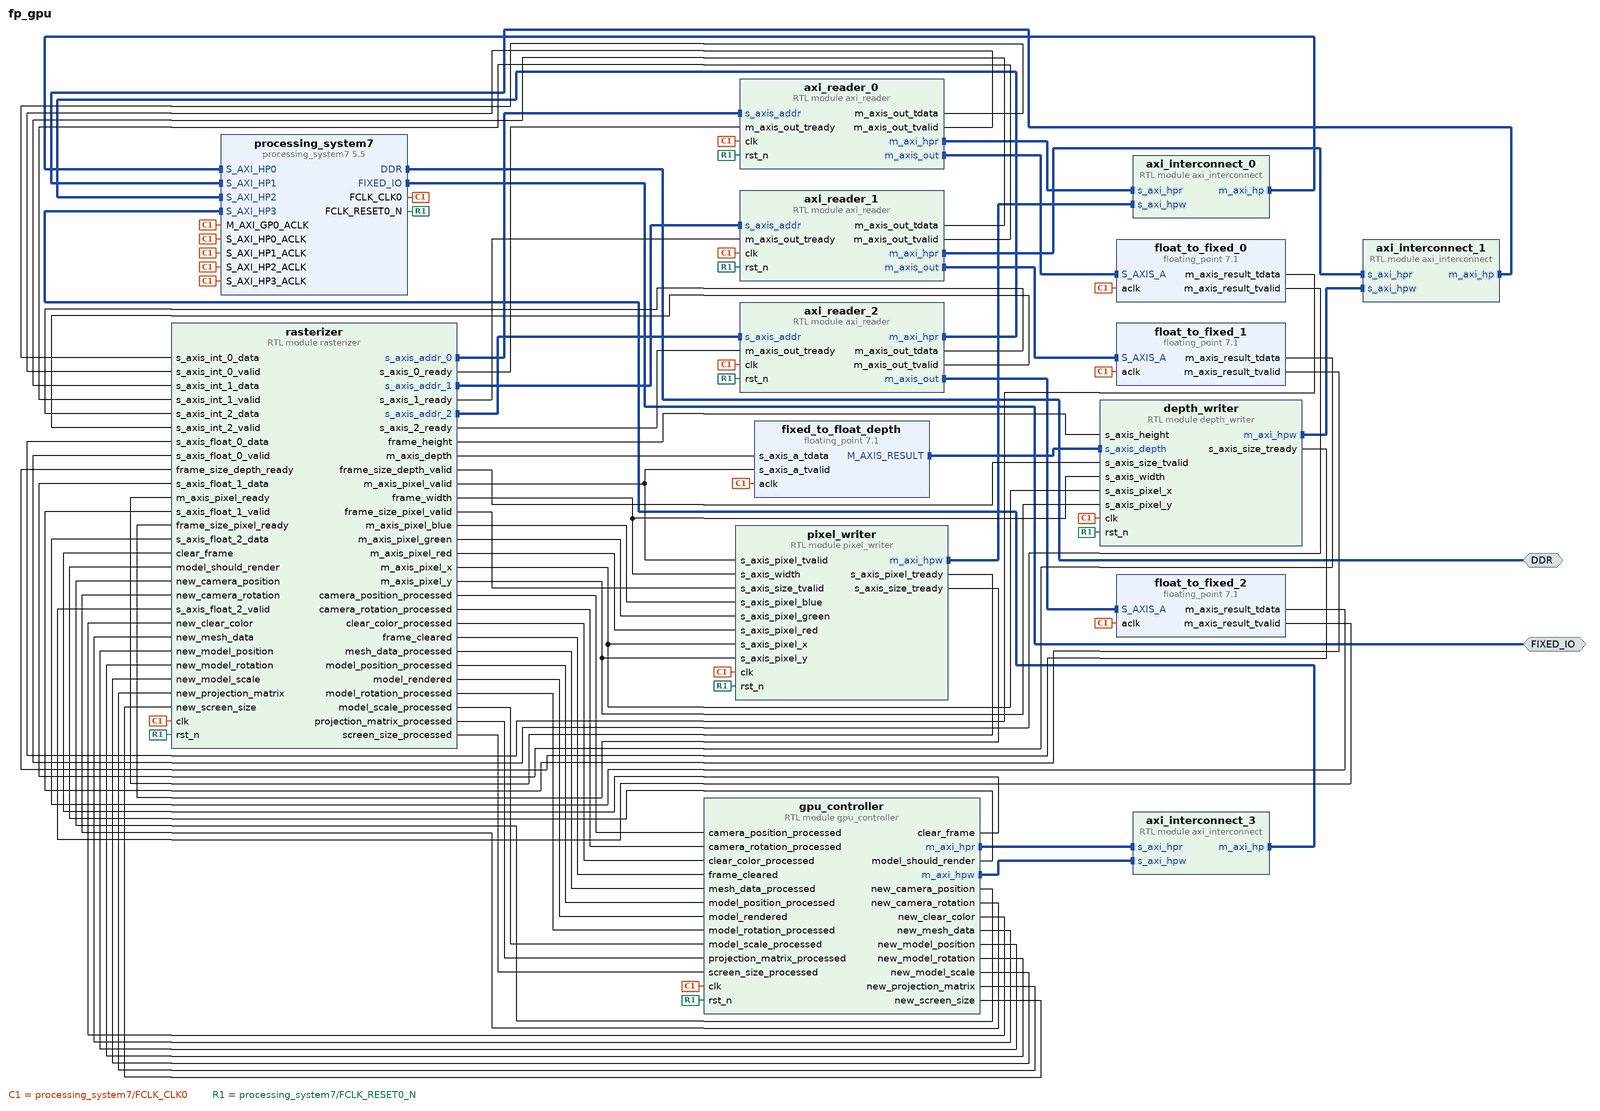
[diagram p0: block diagram of the top level]
# Vivado block design fp_gpu, xc7z020clg400-1, Vivado 2024.2
create_bd_design fp_gpu

create_bd_intf_port -mode Master -vlnv xilinx.com:interface:ddrx_rtl:1.0 DDR
create_bd_intf_port -mode Master -vlnv xilinx.com:display_processing_system7:fixedio_rtl:1.0 FIXED_IO

create_bd_cell -type ip -vlnv xilinx.com:ip:processing_system7:5.5 processing_system7
set_property -dict [list \
  CONFIG.PCW_APU_PERIPHERAL_FREQMHZ 650 \
  CONFIG.PCW_CRYSTAL_PERIPHERAL_FREQMHZ 50 \
  CONFIG.PCW_ENET0_ENET0_IO {MIO 16 .. 27} \
  CONFIG.PCW_ENET0_GRP_MDIO_ENABLE 1 \
  CONFIG.PCW_ENET0_GRP_MDIO_IO {MIO 52 .. 53} \
  CONFIG.PCW_ENET0_PERIPHERAL_ENABLE 1 \
  CONFIG.PCW_ENET0_RESET_ENABLE 1 \
  CONFIG.PCW_ENET0_RESET_IO {MIO 9} \
  CONFIG.PCW_ENET_RESET_ENABLE 1 \
  CONFIG.PCW_ENET_RESET_SELECT {Share reset pin} \
  CONFIG.PCW_FPGA0_PERIPHERAL_FREQMHZ 100 \
  CONFIG.PCW_FPGA1_PERIPHERAL_FREQMHZ 50 \
  CONFIG.PCW_GPIO_MIO_GPIO_ENABLE 1 \
  CONFIG.PCW_GPIO_MIO_GPIO_IO MIO \
  CONFIG.PCW_I2C_RESET_ENABLE 1 \
  CONFIG.PCW_M_AXI_GP0_FREQMHZ 10 \
  CONFIG.PCW_PERIPHERAL_BOARD_PRESET None \
  CONFIG.PCW_PRESET_BANK1_VOLTAGE {LVCMOS 1.8V} \
  CONFIG.PCW_QSPI_GRP_FBCLK_ENABLE 1 \
  CONFIG.PCW_QSPI_GRP_FBCLK_IO {MIO 8} \
  CONFIG.PCW_QSPI_GRP_SINGLE_SS_ENABLE 1 \
  CONFIG.PCW_QSPI_GRP_SINGLE_SS_IO {MIO 1 .. 6} \
  CONFIG.PCW_QSPI_PERIPHERAL_ENABLE 1 \
  CONFIG.PCW_QSPI_QSPI_IO {MIO 1 .. 6} \
  CONFIG.PCW_SD0_GRP_CD_ENABLE 1 \
  CONFIG.PCW_SD0_GRP_CD_IO {MIO 47} \
  CONFIG.PCW_SD0_GRP_WP_ENABLE 0 \
  CONFIG.PCW_SD0_PERIPHERAL_ENABLE 1 \
  CONFIG.PCW_SD0_SD0_IO {MIO 40 .. 45} \
  CONFIG.PCW_SDIO_PERIPHERAL_FREQMHZ 50 \
  CONFIG.PCW_SINGLE_QSPI_DATA_MODE x4 \
  CONFIG.PCW_S_AXI_HP0_DATA_WIDTH 32 \
  CONFIG.PCW_S_AXI_HP1_DATA_WIDTH 32 \
  CONFIG.PCW_S_AXI_HP2_DATA_WIDTH 32 \
  CONFIG.PCW_S_AXI_HP3_DATA_WIDTH 32 \
  CONFIG.PCW_UART0_PERIPHERAL_ENABLE 1 \
  CONFIG.PCW_UART0_UART0_IO {MIO 14 .. 15} \
  CONFIG.PCW_UART1_PERIPHERAL_ENABLE 0 \
  CONFIG.PCW_UART_PERIPHERAL_FREQMHZ 100 \
  CONFIG.PCW_UIPARAM_DDR_BUS_WIDTH {16 Bit} \
  CONFIG.PCW_UIPARAM_DDR_FREQ_MHZ 525 \
  CONFIG.PCW_UIPARAM_DDR_PARTNO {MT41J256M16 RE-125} \
  CONFIG.PCW_USB0_PERIPHERAL_ENABLE 0 \
  CONFIG.PCW_USB0_RESET_ENABLE 1 \
  CONFIG.PCW_USB0_RESET_IO {MIO 46} \
  CONFIG.PCW_USB_RESET_ENABLE 1 \
  CONFIG.PCW_USE_S_AXI_HP0 1 \
  CONFIG.PCW_USE_S_AXI_HP1 1 \
  CONFIG.PCW_USE_S_AXI_HP2 1 \
  CONFIG.PCW_USE_S_AXI_HP3 1 \
] [get_bd_cells processing_system7]
# 485 more settings of processing_system7 are not shown: defaults, MIO pin electricals, DDR timing, and values the tool derives
create_bd_cell -type module -reference axi_interconnect axi_interconnect_0
create_bd_cell -type module -reference axi_interconnect axi_interconnect_1
create_bd_cell -type module -reference axi_interconnect axi_interconnect_3
create_bd_cell -type module -reference gpu_controller gpu_controller
create_bd_cell -type module -reference axi_reader axi_reader_0
create_bd_cell -type module -reference axi_reader axi_reader_1
create_bd_cell -type module -reference axi_reader axi_reader_2
create_bd_cell -type module -reference depth_writer depth_writer
create_bd_cell -type module -reference pixel_writer pixel_writer
create_bd_cell -type ip -vlnv xilinx.com:ip:floating_point:7.1 fixed_to_float_depth
set_property -dict [list \
  CONFIG.A_Precision_Type Custom \
  CONFIG.C_A_Exponent_Width 32 \
  CONFIG.C_A_Fraction_Width 32 \
  CONFIG.C_Accum_Input_Msb 32 \
  CONFIG.C_Accum_Lsb -31 \
  CONFIG.C_Accum_Msb 32 \
  CONFIG.C_Latency 7 \
  CONFIG.C_Mult_Usage No_Usage \
  CONFIG.C_Rate 1 \
  CONFIG.C_Result_Exponent_Width 8 \
  CONFIG.C_Result_Fraction_Width 24 \
  CONFIG.Flow_Control NonBlocking \
  CONFIG.Has_RESULT_TREADY false \
  CONFIG.Operation_Type Fixed_to_float \
  CONFIG.Result_Precision_Type Single \
] [get_bd_cells fixed_to_float_depth]
create_bd_cell -type ip -vlnv xilinx.com:ip:floating_point:7.1 float_to_fixed_2
set_property -dict [list \
  CONFIG.C_Latency 6 \
  CONFIG.C_Mult_Usage No_Usage \
  CONFIG.C_Rate 1 \
  CONFIG.C_Result_Exponent_Width 32 \
  CONFIG.C_Result_Fraction_Width 32 \
  CONFIG.Flow_Control NonBlocking \
  CONFIG.Has_RESULT_TREADY false \
  CONFIG.Operation_Type Float_to_fixed \
  CONFIG.Result_Precision_Type Custom \
] [get_bd_cells float_to_fixed_2]
create_bd_cell -type ip -vlnv xilinx.com:ip:floating_point:7.1 float_to_fixed_1
set_property -dict [list \
  CONFIG.C_Latency 6 \
  CONFIG.C_Mult_Usage No_Usage \
  CONFIG.C_Rate 1 \
  CONFIG.C_Result_Exponent_Width 32 \
  CONFIG.C_Result_Fraction_Width 32 \
  CONFIG.Flow_Control NonBlocking \
  CONFIG.Has_RESULT_TREADY false \
  CONFIG.Operation_Type Float_to_fixed \
  CONFIG.Result_Precision_Type Custom \
] [get_bd_cells float_to_fixed_1]
create_bd_cell -type ip -vlnv xilinx.com:ip:floating_point:7.1 float_to_fixed_0
set_property -dict [list \
  CONFIG.C_Latency 6 \
  CONFIG.C_Mult_Usage No_Usage \
  CONFIG.C_Rate 1 \
  CONFIG.C_Result_Exponent_Width 32 \
  CONFIG.C_Result_Fraction_Width 32 \
  CONFIG.Flow_Control NonBlocking \
  CONFIG.Has_RESULT_TREADY false \
  CONFIG.Operation_Type Float_to_fixed \
  CONFIG.Result_Precision_Type Custom \
] [get_bd_cells float_to_fixed_0]
create_bd_cell -type module -reference rasterizer rasterizer

# ---- connections ----

connect_bd_intf_net [get_bd_intf_pins axi_interconnect_0/m_axi_hp] [get_bd_intf_pins processing_system7/S_AXI_HP0]
connect_bd_intf_net [get_bd_intf_pins axi_interconnect_1/m_axi_hp] [get_bd_intf_pins processing_system7/S_AXI_HP1]
connect_bd_intf_net [get_bd_intf_pins axi_interconnect_3/m_axi_hp] [get_bd_intf_pins processing_system7/S_AXI_HP3]
connect_bd_intf_net [get_bd_intf_pins axi_reader_0/m_axi_hpr] [get_bd_intf_pins axi_interconnect_0/s_axi_hpr]
connect_bd_intf_net -intf_net axi_reader_0_s_axis_out [get_bd_intf_pins float_to_fixed_0/S_AXIS_A] [get_bd_intf_pins axi_reader_0/m_axis_out]
connect_bd_intf_net [get_bd_intf_pins axi_reader_1/m_axi_hpr] [get_bd_intf_pins axi_interconnect_1/s_axi_hpr]
connect_bd_intf_net -intf_net axi_reader_1_s_axis_out [get_bd_intf_pins float_to_fixed_1/S_AXIS_A] [get_bd_intf_pins axi_reader_1/m_axis_out]
connect_bd_intf_net [get_bd_intf_pins axi_reader_2/m_axi_hpr] [get_bd_intf_pins processing_system7/S_AXI_HP2]
connect_bd_intf_net -intf_net axi_reader_2_s_axis_out [get_bd_intf_pins float_to_fixed_2/S_AXIS_A] [get_bd_intf_pins axi_reader_2/m_axis_out]
connect_bd_intf_net [get_bd_intf_pins depth_writer/m_axi_hpw] [get_bd_intf_pins axi_interconnect_1/s_axi_hpw]
connect_bd_intf_net [get_bd_intf_pins fixed_to_float_depth/M_AXIS_RESULT] [get_bd_intf_pins depth_writer/s_axis_depth]
connect_bd_intf_net [get_bd_intf_pins axi_interconnect_3/s_axi_hpr] [get_bd_intf_pins gpu_controller/m_axi_hpr]
connect_bd_intf_net [get_bd_intf_pins gpu_controller/m_axi_hpw] [get_bd_intf_pins axi_interconnect_3/s_axi_hpw]
connect_bd_intf_net -intf_net pixel_writer_0_m_axi_hpw [get_bd_intf_pins pixel_writer/m_axi_hpw] [get_bd_intf_pins axi_interconnect_0/s_axi_hpw]
connect_bd_intf_net -intf_net processing_system7_0_DDR [get_bd_intf_ports DDR] [get_bd_intf_pins processing_system7/DDR]
connect_bd_intf_net -intf_net processing_system7_0_FIXED_IO [get_bd_intf_ports FIXED_IO] [get_bd_intf_pins processing_system7/FIXED_IO]
connect_bd_intf_net [get_bd_intf_pins rasterizer/s_axis_addr_0] [get_bd_intf_pins axi_reader_0/s_axis_addr]
connect_bd_intf_net [get_bd_intf_pins rasterizer/s_axis_addr_1] [get_bd_intf_pins axi_reader_1/s_axis_addr]
connect_bd_intf_net [get_bd_intf_pins rasterizer/s_axis_addr_2] [get_bd_intf_pins axi_reader_2/s_axis_addr]
connect_bd_net [get_bd_pins processing_system7/FCLK_CLK0] \
  [get_bd_pins processing_system7/S_AXI_HP0_ACLK] [get_bd_pins processing_system7/S_AXI_HP1_ACLK] \
  [get_bd_pins processing_system7/S_AXI_HP2_ACLK] [get_bd_pins processing_system7/S_AXI_HP3_ACLK] \
  [get_bd_pins processing_system7/M_AXI_GP0_ACLK] [get_bd_pins fixed_to_float_depth/aclk] [get_bd_pins float_to_fixed_2/aclk] \
  [get_bd_pins float_to_fixed_0/aclk] [get_bd_pins float_to_fixed_1/aclk] [get_bd_pins axi_reader_0/clk] \
  [get_bd_pins axi_reader_1/clk] [get_bd_pins axi_reader_2/clk] [get_bd_pins depth_writer/clk] [get_bd_pins rasterizer/clk] \
  [get_bd_pins pixel_writer/clk] [get_bd_pins gpu_controller/clk]
connect_bd_net [get_bd_pins axi_reader_0/m_axis_out_tdata] [get_bd_pins rasterizer/s_axis_int_0_data]
connect_bd_net [get_bd_pins axi_reader_0/m_axis_out_tvalid] [get_bd_pins rasterizer/s_axis_int_0_valid]
connect_bd_net [get_bd_pins axi_reader_1/m_axis_out_tdata] [get_bd_pins rasterizer/s_axis_int_1_data]
connect_bd_net [get_bd_pins axi_reader_1/m_axis_out_tvalid] [get_bd_pins rasterizer/s_axis_int_1_valid]
connect_bd_net [get_bd_pins axi_reader_2/m_axis_out_tdata] [get_bd_pins rasterizer/s_axis_int_2_data]
connect_bd_net [get_bd_pins axi_reader_2/m_axis_out_tvalid] [get_bd_pins rasterizer/s_axis_int_2_valid]
connect_bd_net [get_bd_pins depth_writer/s_axis_size_tready] [get_bd_pins rasterizer/frame_size_depth_ready]
connect_bd_net [get_bd_pins float_to_fixed_0/m_axis_result_tdata] [get_bd_pins rasterizer/s_axis_float_0_data]
connect_bd_net [get_bd_pins float_to_fixed_0/m_axis_result_tvalid] [get_bd_pins rasterizer/s_axis_float_0_valid]
connect_bd_net [get_bd_pins float_to_fixed_1/m_axis_result_tdata] [get_bd_pins rasterizer/s_axis_float_1_data]
connect_bd_net [get_bd_pins float_to_fixed_1/m_axis_result_tvalid] [get_bd_pins rasterizer/s_axis_float_1_valid]
connect_bd_net [get_bd_pins float_to_fixed_2/m_axis_result_tdata] [get_bd_pins rasterizer/s_axis_float_2_data]
connect_bd_net [get_bd_pins float_to_fixed_2/m_axis_result_tvalid] [get_bd_pins rasterizer/s_axis_float_2_valid]
connect_bd_net [get_bd_pins gpu_controller/clear_frame] [get_bd_pins rasterizer/clear_frame]
connect_bd_net [get_bd_pins gpu_controller/model_should_render] [get_bd_pins rasterizer/model_should_render]
connect_bd_net [get_bd_pins gpu_controller/new_camera_position] [get_bd_pins rasterizer/new_camera_position]
connect_bd_net [get_bd_pins gpu_controller/new_camera_rotation] [get_bd_pins rasterizer/new_camera_rotation]
connect_bd_net [get_bd_pins gpu_controller/new_clear_color] [get_bd_pins rasterizer/new_clear_color]
connect_bd_net [get_bd_pins gpu_controller/new_mesh_data] [get_bd_pins rasterizer/new_mesh_data]
connect_bd_net [get_bd_pins gpu_controller/new_model_position] [get_bd_pins rasterizer/new_model_position]
connect_bd_net [get_bd_pins gpu_controller/new_model_rotation] [get_bd_pins rasterizer/new_model_rotation]
connect_bd_net [get_bd_pins gpu_controller/new_model_scale] [get_bd_pins rasterizer/new_model_scale]
connect_bd_net [get_bd_pins gpu_controller/new_projection_matrix] [get_bd_pins rasterizer/new_projection_matrix]
connect_bd_net [get_bd_pins gpu_controller/new_screen_size] [get_bd_pins rasterizer/new_screen_size]
connect_bd_net [get_bd_pins pixel_writer/s_axis_pixel_tready] [get_bd_pins rasterizer/m_axis_pixel_ready]
connect_bd_net [get_bd_pins pixel_writer/s_axis_size_tready] [get_bd_pins rasterizer/frame_size_pixel_ready]
connect_bd_net [get_bd_pins processing_system7/FCLK_RESET0_N] \
  [get_bd_pins axi_reader_0/rst_n] [get_bd_pins axi_reader_1/rst_n] [get_bd_pins axi_reader_2/rst_n] \
  [get_bd_pins depth_writer/rst_n] [get_bd_pins rasterizer/rst_n] [get_bd_pins pixel_writer/rst_n] \
  [get_bd_pins gpu_controller/rst_n]
connect_bd_net [get_bd_pins rasterizer/camera_position_processed] [get_bd_pins gpu_controller/camera_position_processed]
connect_bd_net [get_bd_pins rasterizer/camera_rotation_processed] [get_bd_pins gpu_controller/camera_rotation_processed]
connect_bd_net [get_bd_pins rasterizer/clear_color_processed] [get_bd_pins gpu_controller/clear_color_processed]
connect_bd_net [get_bd_pins rasterizer/frame_cleared] [get_bd_pins gpu_controller/frame_cleared]
connect_bd_net [get_bd_pins rasterizer/frame_height] [get_bd_pins depth_writer/s_axis_height]
connect_bd_net [get_bd_pins rasterizer/frame_size_depth_valid] [get_bd_pins depth_writer/s_axis_size_tvalid]
connect_bd_net [get_bd_pins rasterizer/frame_size_pixel_valid] [get_bd_pins pixel_writer/s_axis_size_tvalid]
connect_bd_net [get_bd_pins rasterizer/frame_width] [get_bd_pins depth_writer/s_axis_width] [get_bd_pins pixel_writer/s_axis_width]
connect_bd_net [get_bd_pins rasterizer/m_axis_depth] [get_bd_pins fixed_to_float_depth/s_axis_a_tdata]
connect_bd_net [get_bd_pins rasterizer/m_axis_pixel_blue] [get_bd_pins pixel_writer/s_axis_pixel_blue]
connect_bd_net [get_bd_pins rasterizer/m_axis_pixel_green] [get_bd_pins pixel_writer/s_axis_pixel_green]
connect_bd_net [get_bd_pins rasterizer/m_axis_pixel_red] [get_bd_pins pixel_writer/s_axis_pixel_red]
connect_bd_net [get_bd_pins rasterizer/m_axis_pixel_valid] \
  [get_bd_pins fixed_to_float_depth/s_axis_a_tvalid] [get_bd_pins pixel_writer/s_axis_pixel_tvalid]
connect_bd_net [get_bd_pins rasterizer/m_axis_pixel_x] [get_bd_pins depth_writer/s_axis_pixel_x] [get_bd_pins pixel_writer/s_axis_pixel_x]
connect_bd_net [get_bd_pins rasterizer/m_axis_pixel_y] [get_bd_pins depth_writer/s_axis_pixel_y] [get_bd_pins pixel_writer/s_axis_pixel_y]
connect_bd_net [get_bd_pins rasterizer/mesh_data_processed] [get_bd_pins gpu_controller/mesh_data_processed]
connect_bd_net [get_bd_pins rasterizer/model_position_processed] [get_bd_pins gpu_controller/model_position_processed]
connect_bd_net [get_bd_pins rasterizer/model_rendered] [get_bd_pins gpu_controller/model_rendered]
connect_bd_net [get_bd_pins rasterizer/model_rotation_processed] [get_bd_pins gpu_controller/model_rotation_processed]
connect_bd_net [get_bd_pins rasterizer/model_scale_processed] [get_bd_pins gpu_controller/model_scale_processed]
connect_bd_net [get_bd_pins rasterizer/projection_matrix_processed] [get_bd_pins gpu_controller/projection_matrix_processed]
connect_bd_net [get_bd_pins rasterizer/s_axis_0_ready] [get_bd_pins axi_reader_0/m_axis_out_tready]
connect_bd_net [get_bd_pins rasterizer/s_axis_1_ready] [get_bd_pins axi_reader_1/m_axis_out_tready]
connect_bd_net [get_bd_pins rasterizer/s_axis_2_ready] [get_bd_pins axi_reader_2/m_axis_out_tready]
connect_bd_net [get_bd_pins rasterizer/screen_size_processed] [get_bd_pins gpu_controller/screen_size_processed]

validate_bd_design
save_bd_design
